# Altium project XL4015_5A.PrjPcb
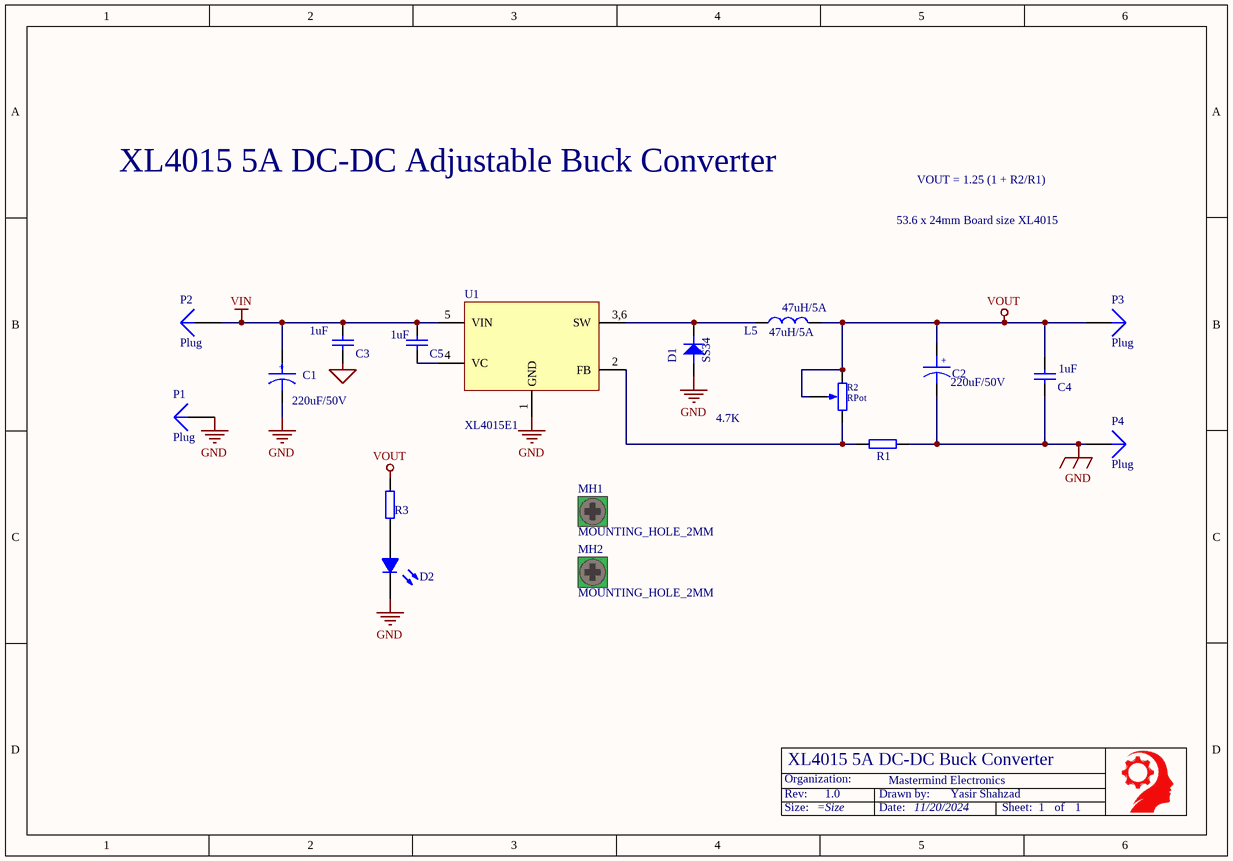
[diagram p0: XL4015_5A.SchDoc]
1 sheet, 19 parts. Net scope: global (net labels, ports and power ports of the same name join across sheets).
Board file: XL4015_5A.PcbDoc

## Sheet XL4015_5A.SchDoc: XL4015 5A DC-DC Buck Converter
size 229 x 160 mm; Date: 11/20/2024; DrawnBy: Yasir Shahzad; Organization: Mastermind Electronics; Address1: L3, 12a Rodborough Rd; Address2: Frenchs Forest; Address3: NSW; Address4: Australia 2086; Revision: 1.0; SheetNumber: 1; SheetTotal: 1

### Parts
*  TitleBlock  (value not drawn)  (graphical)
C1  220uF/50V  [CAP-SMD_BD9.5-L10.0-W10.0-LS12.4-FD]  (value not drawn)
C2  220uF/50V  [CAP-SMD_BD9.5-L10.0-W10.0-LS12.4-FD]  (value not drawn)
C3  1uF/50V  [C0805]  (value not drawn)
C4  1uF/50V  [C0805]  (value not drawn)
C5  1uF/50V  [C0805]  (value not drawn)
D1  SS34  [DO214-AA]
D2  LEDCHIP-LED0805  [CHIP-LED0805]  (value not drawn)
L5  47uH/5A  [TORIDAL-D13_3A]
MH1  MOUNTING_HOLE_2MM  [MOUNTINGHOLE_2.5_PLATED]
MH2  MOUNTING_HOLE_2MM  [MOUNTINGHOLE_2.5_PLATED]
P1  Plug  [PIN1]
P2  Plug  [PIN1]
P3  Plug  [PIN1]
P4  Plug  [PIN1]
R1  1kΩ  [R0805]  (value not drawn)
R2  RPot  [3296Y]
R3  10kΩ  [R0805]  (value not drawn)
U1  XL4015E1  [TO-263-5_L10.2-W8.9-P1.70-TL]

### Nets
GND: C1.2(-) C2.2(-) C3.2 C4.2 D1.A D2.C P1.1 P4.1 R1.2 U1.1(GND)
VIN: C1.1(+) C3.1 C5.1 P2.1 U1.5(VIN)
VOUT: C2.1(+) C4.1 L5.1 P3.1 R2.CW(+) R2.W R3.1
NetC5_2: C5.2 U1.4(VC)
NetD1_C: D1.C L5.2 U1.3,6(SW)
NetD2_A: D2.A R3.2
NetR1_1: R1.1 R2.CCW(-) U1.2(FB)

Not connected (* = marked no-connect by the designer): MH1 MOUNT(3); MH2 MOUNT(3)

### Notes on the sheet
- XL4015 5A DC-DC Adjustable Buck Converter
- VOUT = 1.25 (1 + R2/R1)
- 53.6 x 24mm Board size XL4015
- (near C3) 1uF
- (near C5) 1uF
- (near L5) 47uH/5A
- (near C1) 220uF/50V
- (near C2) 220uF/50V
- (near C4) 1uF
- 4.7K
- (in symbol TitleBlock) Organization:; Rev:; Drawn by:; Size:; Date:; Sheet:; of

### Library data of the parts
* = TitleBlock: Title Block for Schematic Sheets
C1 C2 = CAP-ELECT-SMD
C3-C5 = Cap_0805: Capacitor, X5R, ±10%, 6.3V; Manufacturer: N.A.; Specification: X7R, ±10%, 16V; Value: 1uF/50V
D1 = DIODE-DO214-AA: SMD Diode DO214-AC
D2 = LEDCHIP-LED0805: SMD Lamp beads
L5 = Inductor: Toridal D13 Inductor
MH1 MH2 = MOUNTING_HOLE
R1 R3 = Res_0805: Resistor, ±1%, 0.200W; Manufacturer: *; Specification: ±1%
  R1: Value: 1kΩ
  R3: Value: 10kΩ
R2 = RPot SM_1: Square Trimming Potentiometer; AEMS Code: 1400226
U1 = XL4015E1: Step-down type Adjustable 5A 8V~36V TO-263-5 DC-DC Converters ROHS; pin to pad: 3,6>3+6; Manufacturer: XLSEMI(芯龙); Add into BOM: yes; Switch tube (built-in/external): 内置; Symbol: XL4015E1; Device: XL4015E1; LCSC Part Name: XL4015E1; Supplier Part: C51661; Manufacturer Part: XL4015E1; Supplier Footprint: TO-263-5; JLCPCB Part Class: Extended Part; Datasheet: https://atta.szlcsc.com/upload/public/pdf/source/20150618/1457707323461.pdf; Supplier: LCSC; Convert to PCB: yes; Function: Step-down type; Input Voltage: -; Output Current (Max): -; Switching Frequency: -; Synchronous Rectification: -; Number of Outputs: -; Topology: -
P1-P4 = Plug: LatestRevisionDate: 17-Jul-2002; LatestRevisionNote: Re-released for DXP Platform.; Publisher: Altium Limited